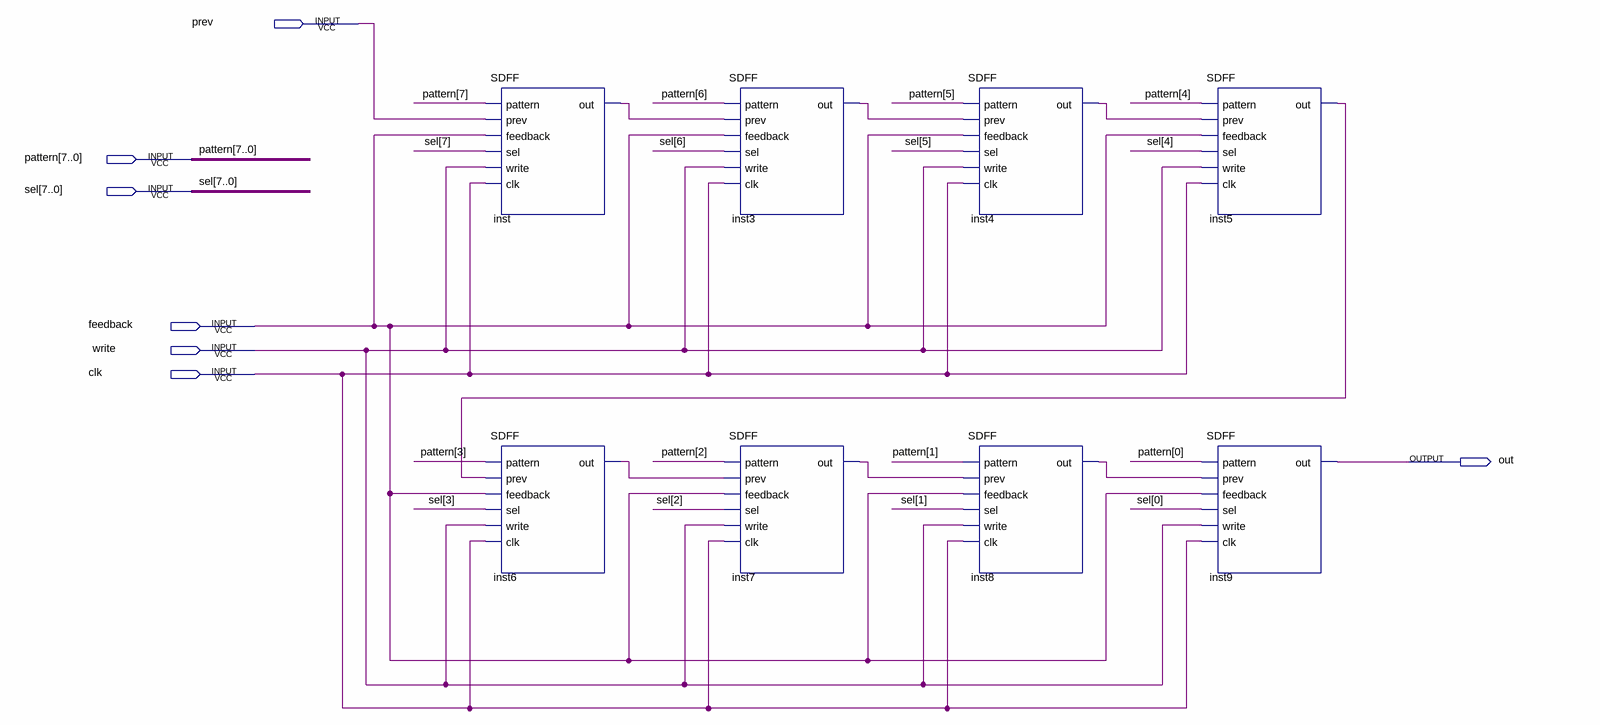
[diagram p0: schematic sheet]
// Quartus schematic SDFF8.bdf as structural Verilog: 8 symbols, 7 pins
module SDFF8 (
  input  prev,
  input  [7:0] pattern,
  input  [7:0] sel,
  input  feedback,
  input  write,
  input  clk,
  output out
);

  wire inst3_out, inst4_out, inst5_out, inst6_out, inst7_out, inst8_out, inst_out;

  SDFF inst (
    .pattern(pattern[7]), .prev(prev), .feedback(feedback), .sel(sel[7]), .write(write), .clk(clk),
    .out(inst_out));
  SDFF inst6 (
    .pattern(pattern[3]), .prev(inst5_out), .feedback(feedback), .sel(sel[3]), .write(write), .clk(clk),
    .out(inst6_out));
  SDFF inst3 (
    .pattern(pattern[6]), .prev(inst_out), .feedback(feedback), .sel(sel[6]), .write(write), .clk(clk),
    .out(inst3_out));
  SDFF inst7 (
    .pattern(pattern[2]), .prev(inst6_out), .feedback(feedback), .sel(sel[2]), .write(write), .clk(clk),
    .out(inst7_out));
  SDFF inst4 (
    .pattern(pattern[5]), .prev(inst3_out), .feedback(feedback), .sel(sel[5]), .write(write), .clk(clk),
    .out(inst4_out));
  SDFF inst8 (
    .pattern(pattern[1]), .prev(inst7_out), .feedback(feedback), .sel(sel[1]), .write(write), .clk(clk),
    .out(inst8_out));
  SDFF inst5 (
    .pattern(pattern[4]), .prev(inst4_out), .feedback(feedback), .sel(sel[4]), .write(write), .clk(clk),
    .out(inst5_out));
  SDFF inst9 (
    .pattern(pattern[0]), .prev(inst8_out), .feedback(feedback), .sel(sel[0]), .write(write), .clk(clk),
    .out(out));
endmodule
